# Altium project lab10.PrjPcb
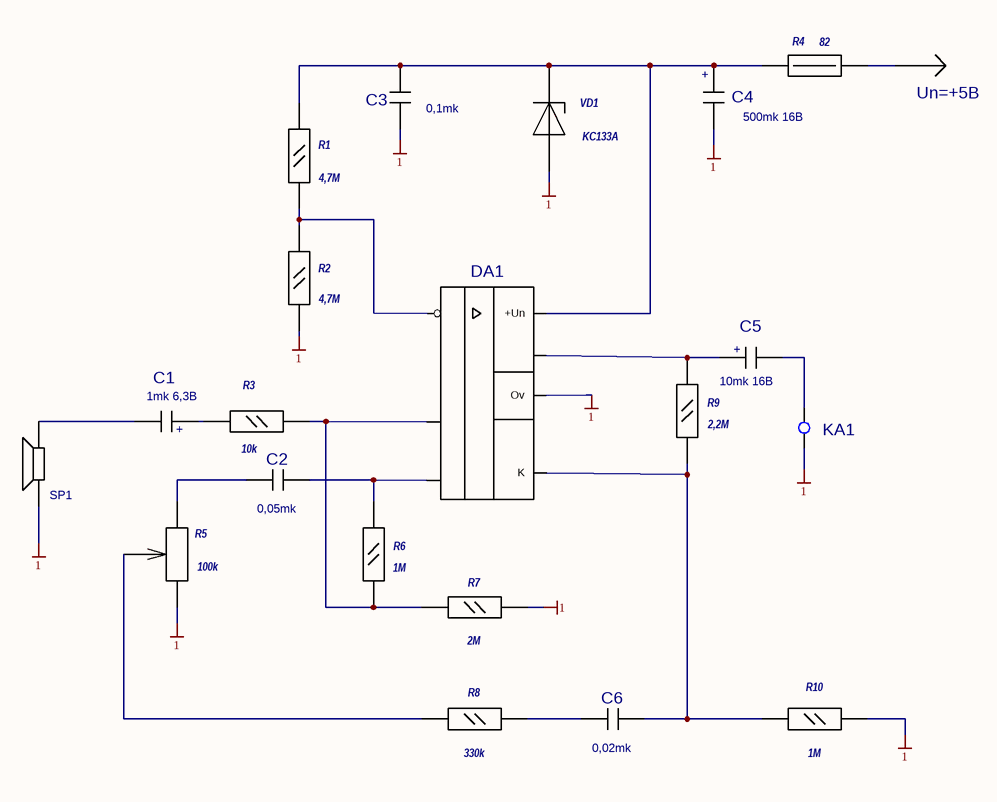
[diagram p0: Lab10.SCHDOC]
1 sheet, 21 parts. Net scope: global (net labels, ports and power ports of the same name join across sheets).

## Sheet Lab10.SCHDOC
size 420 x 297 mm; SheetNumber: 1; SheetTotal: 1; DocumentName: Sheet1.SCHDOC

### Parts
1  value Un=+5B  [1PAD]  (hidden comment: XP_1)
C1  value 1mk 6,3B  [CAP2]  (hidden comment: CAP2)
C2  value 0,05mk  [CAP1]  (hidden comment: CAP1)
C3  value 0,1mk  [CAP1]  (hidden comment: CAP1)
C4  value 500mk 16B  [CAP2]  (hidden comment: CAP2)
C5  value 10mk 16B  [CAP2]  (hidden comment: CAP2)
C6  value 0,02mk  [CAP1]  (hidden comment: CAP1)
DA1  DIP8  [DIP8]  (value not drawn)
KA1  CON2  [2PAD]  (value not drawn)
R1  value 4,7M  [МЛТ(0.125)]  (hidden comment: МЛТ(0.125))
R2  value 4,7M  [МЛТ(0.125)]  (hidden comment: МЛТ(0.125))
R3  value 10k  [МЛТ(0.125)]  (hidden comment: МЛТ(0.125))
R4  value 82  [МЛТ(0.5)]  (hidden comment: RESISTOR)
R5  value 100k  [СП3-38В]  (hidden comment: СП3-38В)
R6  value 1M  [МЛТ(0.125)]  (hidden comment: МЛТ(0.125))
R7  value 2M  [МЛТ(0.125)]  (hidden comment: МЛТ(0.125))
R8  value 330k  [МЛТ(0.125)]  (hidden comment: МЛТ(0.125))
R9  value 2,2M  [МЛТ(0.125)]  (hidden comment: МЛТ(0.125))
R10  value 1M  [МЛТ(0.125)]  (hidden comment: МЛТ(0.125))
SP1  SPEAKER  [CAP1]  (value not drawn)
VD1  KC133A  [KC133A]

### Nets
1: C3.1 C4.2 DA1.6(Ov) KA1.1(A1) R2.1 R5.1 R7.1 R10.2 SP1.1 VD1.1
Net1_1: 1.1(A1) R4.2
NetC1_1: C1.1 R3.1
NetC1_2: C1.2 SP1.2
NetC2_1: C2.1 R5.2
NetC2_2: C2.2 DA1.3(IN2) R6.2
NetC3_2: C3.2 C4.1 DA1.4(+Un) R1.2 R4.1 VD1.2
NetC5_1: C5.1 DA1.5 R9.1
NetC5_2: C5.2 KA1.2(A2)
NetC6_1: C6.1 R8.1
NetC6_2: C6.2 DA1.7(K) R9.2 R10.1
NetDA1_1: DA1.1(IN1) R1.1 R2.2
NetDA1_2: DA1.2(IN2) R3.2 R6.1 R7.2
NetR5_3: R5.3 R8.2

Not connected (* = marked no-connect by the designer): DA1 PWR(GND)

### Notes on the sheet
- (in symbol CAP2) +

### Library data of the parts
DA1 = DIP8: Value: *
SP1 = SPEAKER: Value: *